# Altium schematic sheet System Control - SDRAM.SchDoc
size C
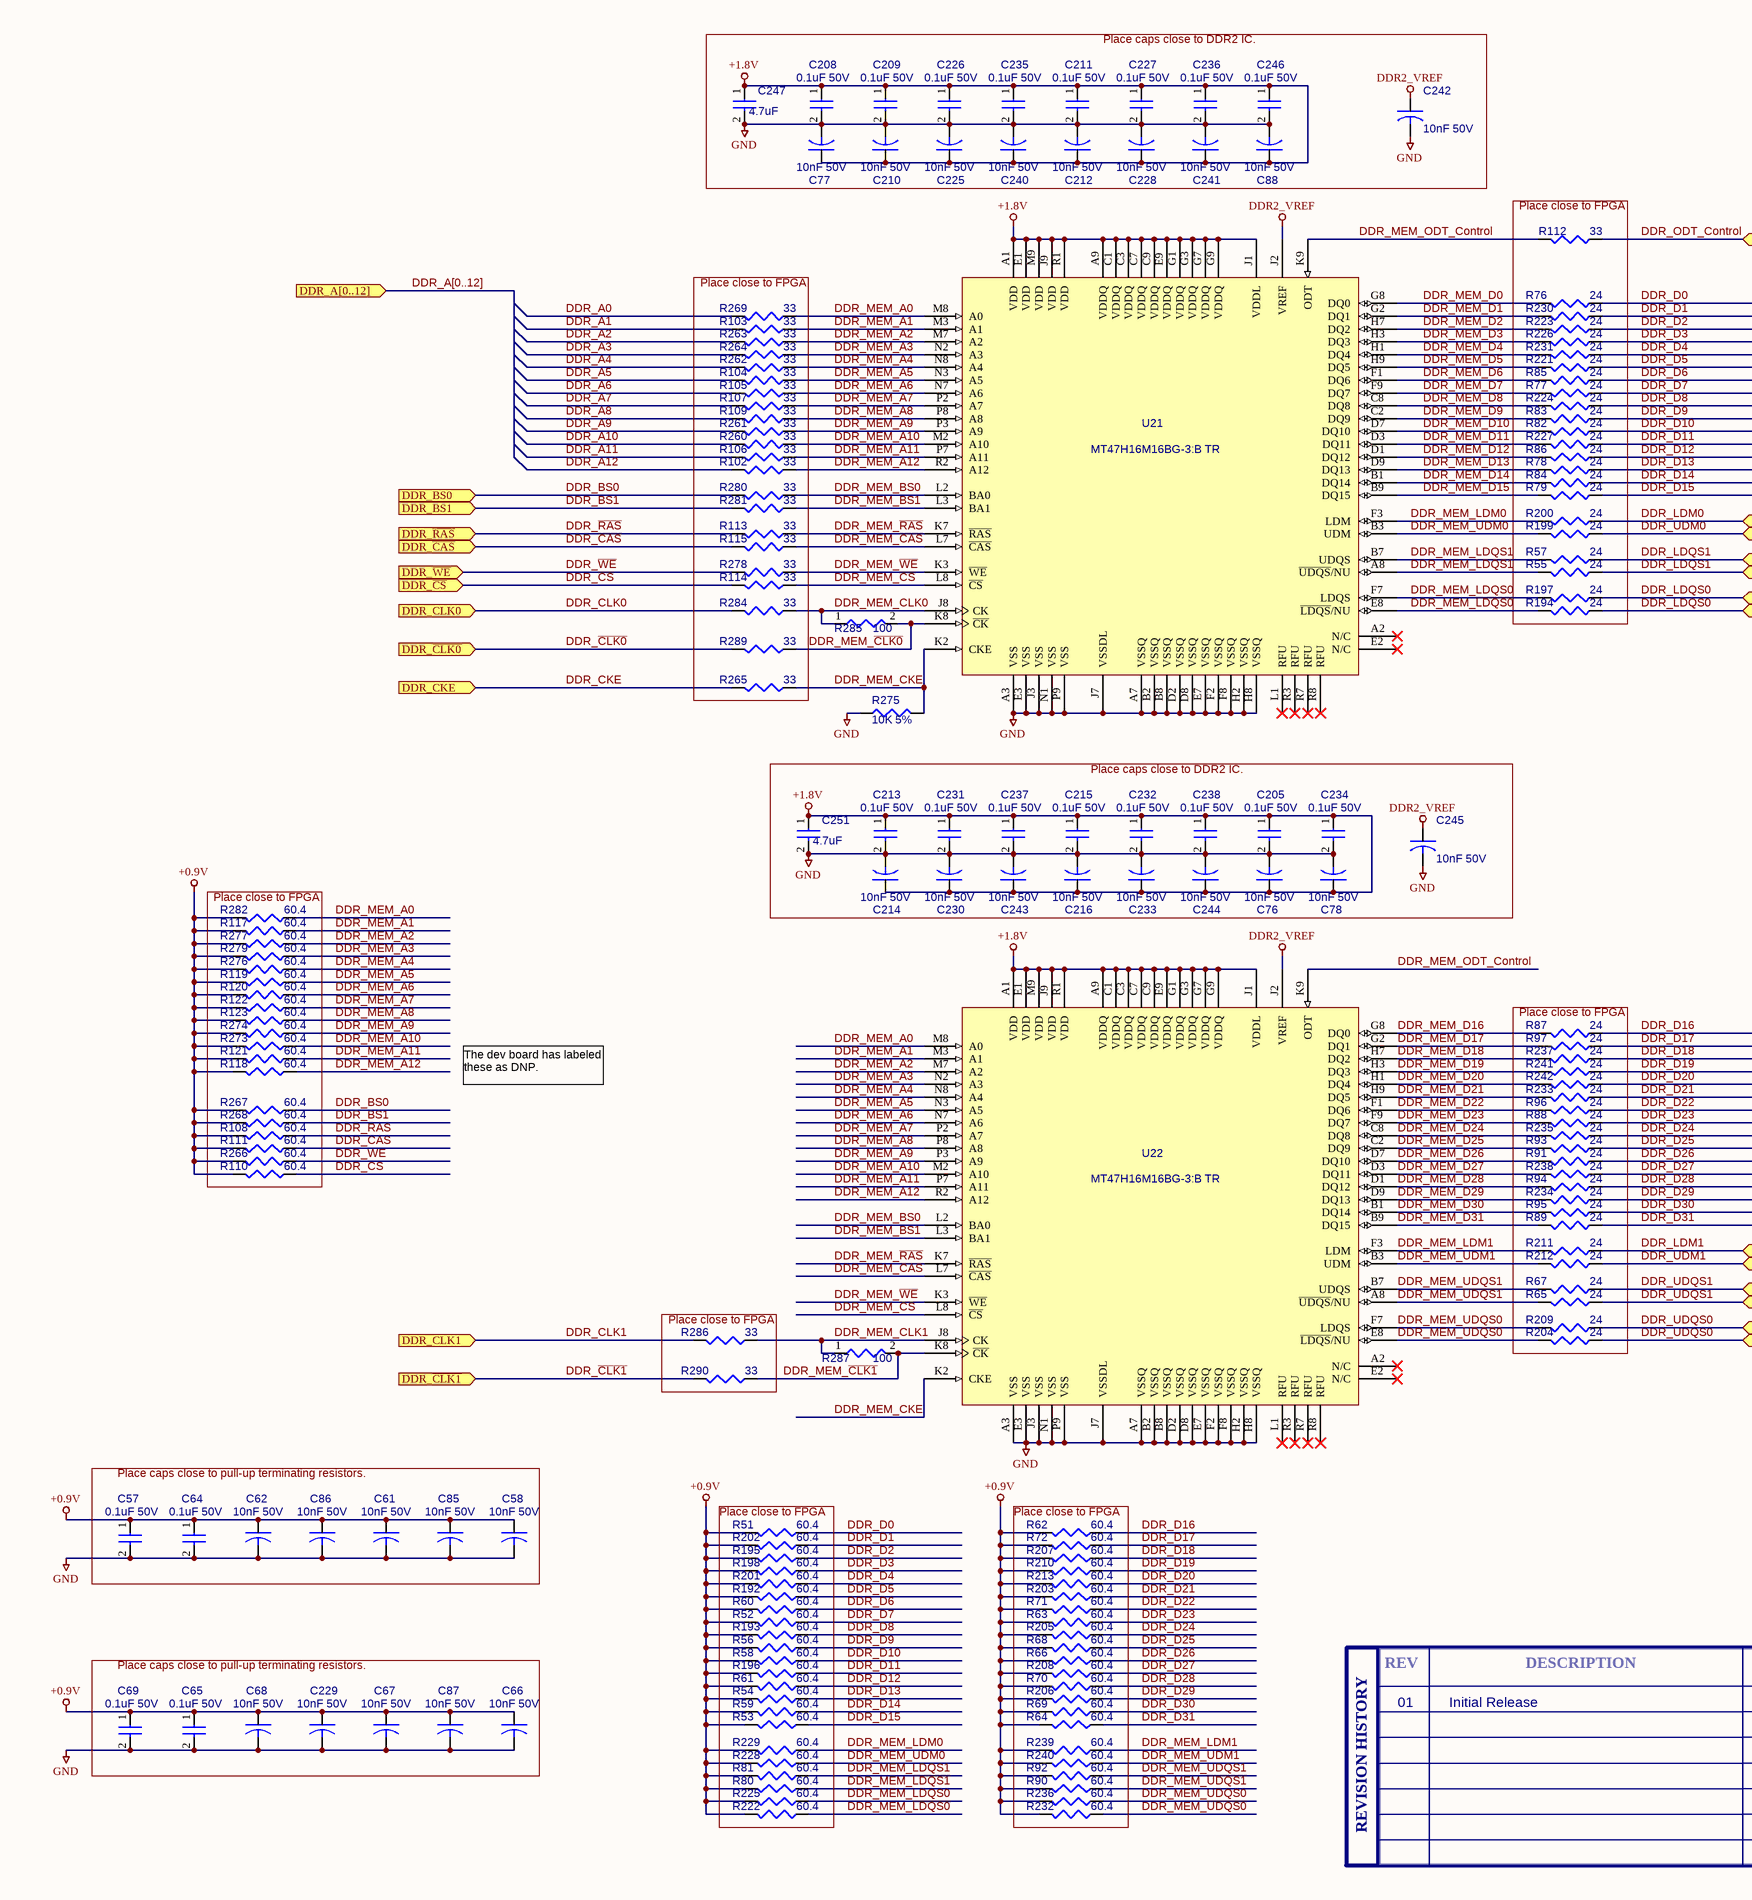
[diagram p0: System Control - SDRAM.SchDoc, left]
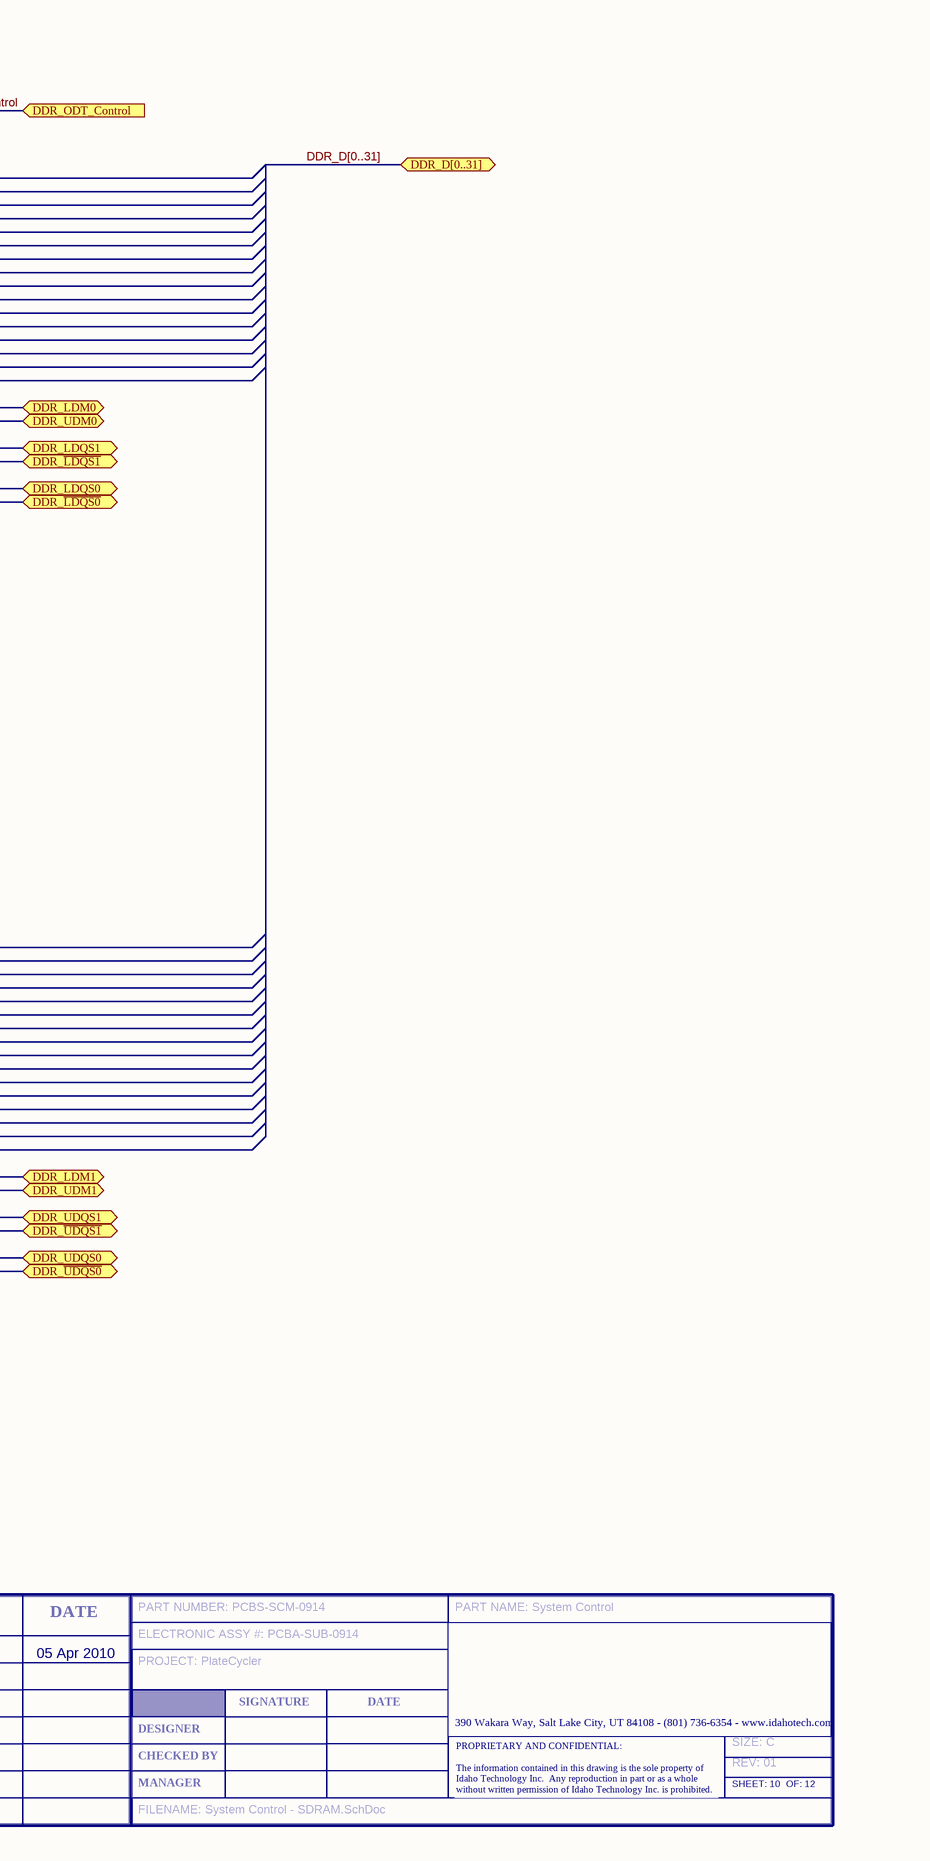
[diagram p1: System Control - SDRAM.SchDoc, right]

## Parts
C57  0.1uF 50V  [SM/C_0603]
C58  10nF 50V  [SM/C_0603]
C61  10nF 50V  [SM/C_0603]
C62  10nF 50V  [SM/C_0603]
C64  0.1uF 50V  [SM/C_0603]
C65  0.1uF 50V  [SM/C_0603]
C66  10nF 50V  [SM/C_0603]
C67  10nF 50V  [SM/C_0603]
C68  10nF 50V  [SM/C_0603]
C69  0.1uF 50V  [SM/C_0603]
C76  10nF 50V  [SM/C_0603]
C77  10nF 50V  [SM/C_0603]
C78  10nF 50V  [SM/C_0603]
C85  10nF 50V  [SM/C_0603]
C86  10nF 50V  [SM/C_0603]
C87  10nF 50V  [SM/C_0603]
C88  10nF 50V  [SM/C_0603]
C205  0.1uF 50V  [SM/C_0603]
C208  0.1uF 50V  [SM/C_0603]
C209  0.1uF 50V  [SM/C_0603]
C210  10nF 50V  [SM/C_0603]
C211  0.1uF 50V  [SM/C_0603]
C212  10nF 50V  [SM/C_0603]
C213  0.1uF 50V  [SM/C_0603]
C214  10nF 50V  [SM/C_0603]
C215  0.1uF 50V  [SM/C_0603]
C216  10nF 50V  [SM/C_0603]
C225  10nF 50V  [SM/C_0603]
C226  0.1uF 50V  [SM/C_0603]
C227  0.1uF 50V  [SM/C_0603]
C228  10nF 50V  [SM/C_0603]
C229  10nF 50V  [SM/C_0603]
C230  10nF 50V  [SM/C_0603]
C231  0.1uF 50V  [SM/C_0603]
C232  0.1uF 50V  [SM/C_0603]
C233  10nF 50V  [SM/C_0603]
C234  0.1uF 50V  [SM/C_0603]
C235  0.1uF 50V  [SM/C_0603]
C236  0.1uF 50V  [SM/C_0603]
C237  0.1uF 50V  [SM/C_0603]
C238  0.1uF 50V  [SM/C_0603]
C240  10nF 50V  [SM/C_0603]
C241  10nF 50V  [SM/C_0603]
C242  10nF 50V  [SM/C_0603]
C243  10nF 50V  [SM/C_0603]
C244  10nF 50V  [SM/C_0603]
C245  10nF 50V  [SM/C_0603]
C246  0.1uF 50V  [SM/C_0603]
C247  4.7uF  [SM/C_0603]
C251  4.7uF  [SM/C_0603]
R51  60.4  [SM/R_0402]
R52  60.4  [SM/R_0402]
R53  60.4  [SM/R_0402]
R54  60.4  [SM/R_0402]
R55  24  [SM/R_0402]
R56  60.4  [SM/R_0402]
R57  24  [SM/R_0402]
R58  60.4  [SM/R_0402]
R59  60.4  [SM/R_0402]
R60  60.4  [SM/R_0402]
R61  60.4  [SM/R_0402]
R62  60.4  [SM/R_0402]
R63  60.4  [SM/R_0402]
R64  60.4  [SM/R_0402]
R65  24  [SM/R_0402]
R66  60.4  [SM/R_0402]
R67  24  [SM/R_0402]
R68  60.4  [SM/R_0402]
R69  60.4  [SM/R_0402]
R70  60.4  [SM/R_0402]
R71  60.4  [SM/R_0402]
R72  60.4  [SM/R_0402]
R76  24  [SM/R_0402]
R77  24  [SM/R_0402]
R78  24  [SM/R_0402]
R79  24  [SM/R_0402]
R80  60.4  [SM/R_0402]
R81  60.4  [SM/R_0402]
R82  24  [SM/R_0402]
R83  24  [SM/R_0402]
R84  24  [SM/R_0402]
R85  24  [SM/R_0402]
R86  24  [SM/R_0402]
R87  24  [SM/R_0402]
R88  24  [SM/R_0402]
R89  24  [SM/R_0402]
R90  60.4  [SM/R_0402]
R91  24  [SM/R_0402]
R92  60.4  [SM/R_0402]
R93  24  [SM/R_0402]
R94  24  [SM/R_0402]
R95  24  [SM/R_0402]
R96  24  [SM/R_0402]
R97  24  [SM/R_0402]
R102  33  [SM/R_0402]
R103  33  [SM/R_0402]
R104  33  [SM/R_0402]
R105  33  [SM/R_0402]
R106  33  [SM/R_0402]
R107  33  [SM/R_0402]
R108  60.4  [SM/R_0402]
R109  33  [SM/R_0402]
R110  60.4  [SM/R_0402]
R111  60.4  [SM/R_0402]
R112  33  [SM/R_0402]
R113  33  [SM/R_0402]
R114  33  [SM/R_0402]
R115  33  [SM/R_0402]
R117  60.4  [SM/R_0402]
R118  60.4  [SM/R_0402]
R119  60.4  [SM/R_0402]
R120  60.4  [SM/R_0402]
R121  60.4  [SM/R_0402]
R122  60.4  [SM/R_0402]
R123  60.4  [SM/R_0402]
R192  60.4  [SM/R_0402]
R193  60.4  [SM/R_0402]
R194  24  [SM/R_0402]
R195  60.4  [SM/R_0402]
R196  60.4  [SM/R_0402]
R197  24  [SM/R_0402]
R198  60.4  [SM/R_0402]
R199  24  [SM/R_0402]
R200  24  [SM/R_0402]
R201  60.4  [SM/R_0402]
R202  60.4  [SM/R_0402]
R203  60.4  [SM/R_0402]
R204  24  [SM/R_0402]
R205  60.4  [SM/R_0402]
R206  60.4  [SM/R_0402]
R207  60.4  [SM/R_0402]
R208  60.4  [SM/R_0402]
R209  24  [SM/R_0402]
R210  60.4  [SM/R_0402]
R211  24  [SM/R_0402]
R212  24  [SM/R_0402]
R213  60.4  [SM/R_0402]
R221  24  [SM/R_0402]
R222  60.4  [SM/R_0402]
R223  24  [SM/R_0402]
R224  24  [SM/R_0402]
R225  60.4  [SM/R_0402]
R226  24  [SM/R_0402]
R227  24  [SM/R_0402]
R228  60.4  [SM/R_0402]
R229  60.4  [SM/R_0402]
R230  24  [SM/R_0402]
R231  24  [SM/R_0402]
R232  60.4  [SM/R_0402]
R233  24  [SM/R_0402]
R234  24  [SM/R_0402]
R235  24  [SM/R_0402]
R236  60.4  [SM/R_0402]
R237  24  [SM/R_0402]
R238  24  [SM/R_0402]
R239  60.4  [SM/R_0402]
R240  60.4  [SM/R_0402]
R241  24  [SM/R_0402]
R242  24  [SM/R_0402]
R260  33  [SM/R_0402]
R261  33  [SM/R_0402]
R262  33  [SM/R_0402]
R263  33  [SM/R_0402]
R264  33  [SM/R_0402]
R265  33  [SM/R_0402]
R266  60.4  [SM/R_0402]
R267  60.4  [SM/R_0402]
R268  60.4  [SM/R_0402]
R269  33  [SM/R_0402]
R273  60.4  [SM/R_0402]
R274  60.4  [SM/R_0402]
R275  10K 5%  [SM/R_0603]
R276  60.4  [SM/R_0402]
R277  60.4  [SM/R_0402]
R278  33  [SM/R_0402]
R279  60.4  [SM/R_0402]
R280  33  [SM/R_0402]
R281  33  [SM/R_0402]
R282  60.4  [SM/R_0402]
R284  33  [SM/R_0402]
R285  100  [SM/R_0603]
R286  33  [SM/R_0402]
R287  100  [SM/R_0603]
R289  33  [SM/R_0402]
R290  33  [SM/R_0402]
T?  SIZE: C  REV: 01  FILENAME: System Control - SDRAM.SchDoc  PART NUMBER: PCBS-SCM-0914  PART NAME: System Control  ELECTRONIC ASSY #: PCBA-SUB-0914  PROJECT: PlateCycler  SHEET: 10  OF: 12  (hidden comment: ITI Title Block, A Size)  (graphical)
U21  MT47H16M16BG-3:B TR  [84FBGA]
U22  MT47H16M16BG-3:B TR  [84FBGA]

## Blocks framed on the sheet
Place caps close to DDR2 IC.: C77 C88 C208-C212 C225-C228 C235 C236 C240-C242 C246 C247
Place close to FPGA: R55 R57 R76-R79 R82-R86 R112 R194 R197 R199 R200 R221 R223 R224 R226 R227 R230 R231
Place close to FPGA: R102-R107 R109 R113-R115 R260-R265 R269 R278 R280 R281 R284 R289
Place caps close to DDR2 IC.: C76 C78 C205 C213-C216 C230-C234 C237 C238 C243-C245 C251
Place close to FPGA: R108 R110 R111 R117-R123 R266-R268 R273 R274 R276 R277 R279 R282
Place close to FPGA: R65 R67 R87-R89 R91 R93-R97 R204 R209 R211 R212 R233-R235 R237 R238 R241 R242
Place close to FPGA: R286 R290
Place caps close to pull-up terminating resistors.: C57 C58 C61 C62 C64 C85 C86
Place close to FPGA: R51-R54 R56 R58-R61 R80 R81 R192 R193 R195 R196 R198 R201 R202 R222 R225 R228 R229
Place close to FPGA: R62-R64 R66 R68-R72 R90 R92 R203 R205-R208 R210 R213 R232 R236 R239 R240
Place caps close to pull-up terminating resistors.: C65-C69 C87 C229

## Ports
DDR_A[0..12] (in), DDR_BS0 (in), DDR_BS1 (in), DDR_CKE (in), DDR_CLK0 (in), DDR_CLK1 (in), DDR_D[0..31] (bidir), DDR_LDM0 (bidir), DDR_LDM1 (bidir), DDR_LDQS0 (bidir), DDR_LDQS1 (bidir), DDR_ODT_Control (in), DDR_UDM0 (bidir), DDR_UDM1 (bidir), DDR_UDQS0 (bidir), DDR_UDQS1 (bidir), DDR_~{CAS} (in), DDR_~{CLK0} (in), DDR_~{CLK1} (in), DDR_~{CS} (in), DDR_~{LDQS0} (bidir), DDR_~{LDQS1} (bidir), DDR_~{RAS} (in), DDR_~{UDQS0} (bidir), DDR_~{UDQS1} (bidir), DDR_~{WE} (in)

## Nets
+0.9V: C57.1 C58.1 C61.1 C62.1 C64.1 C65.1 C66.1 C67.1 C68.1 C69.1 C85.1 C86.1 C87.1 C229.1 R51.2 R52.2 R53.2 R54.2 R56.2 R58.2 R59.2 R60.2 R61.2 R62.2 R63.2 R64.2 R66.2 R68.2 R69.2 R70.2 R71.2 R72.2 R80.2 R81.2 R90.2 R92.2 R108.2 R110.2 R111.2 R117.2 R118.2 R119.2 R120.2 R121.2 R122.2 R123.2 R192.2 R193.2 R195.2 R196.2 R198.2 R201.2 R202.2 R203.2 R205.2 R206.2 R207.2 R208.2 R210.2 R213.2 R222.2 R225.2 R228.2 R229.2 R232.2 R236.2 R239.2 R240.2 R266.2 R267.2 R268.2 R273.2 R274.2 R276.2 R277.2 R279.2 R282.2
+1.8V: C76.1 C77.1 C78.1 C88.1 C205.1 C208.1 C209.1 C210.1 C211.1 C212.1 C213.1 C214.1 C215.1 C216.1 C225.1 C226.1 C227.1 C228.1 C230.1 C231.1 C232.1 C233.1 C234.1 C235.1 C236.1 C237.1 C238.1 C240.1 C241.1 C243.1 C244.1 C246.1 C247.1 C251.1 U21.A1(VDD) U21.A9(VDDQ) U21.C1(VDDQ) U21.C3(VDDQ) U21.C7(VDDQ) U21.C9(VDDQ) U21.E1(VDD) U21.E9(VDDQ) U21.G1(VDDQ) U21.G3(VDDQ) U21.G7(VDDQ) U21.G9(VDDQ) U21.J1(VDDL) U21.J9(VDD) U21.M9(VDD) U21.R1(VDD) U22.A1(VDD) U22.A9(VDDQ) U22.C1(VDDQ) U22.C3(VDDQ) U22.C7(VDDQ) U22.C9(VDDQ) U22.E1(VDD) U22.E9(VDDQ) U22.G1(VDDQ) U22.G3(VDDQ) U22.G7(VDDQ) U22.G9(VDDQ) U22.J1(VDDL) U22.J9(VDD) U22.M9(VDD) U22.R1(VDD)
DDR2_VREF: C242.1 C245.1 U21.J2(VREF) U22.J2(VREF)
GND: C57.2 C58.2 C61.2 C62.2 C64.2 C65.2 C66.2 C67.2 C68.2 C69.2 C76.2 C77.2 C78.2 C85.2 C86.2 C87.2 C88.2 C205.2 C208.2 C209.2 C210.2 C211.2 C212.2 C213.2 C214.2 C215.2 C216.2 C225.2 C226.2 C227.2 C228.2 C229.2 C230.2 C231.2 C232.2 C233.2 C234.2 C235.2 C236.2 C237.2 C238.2 C240.2 C241.2 C242.2 C243.2 C244.2 C245.2 C246.2 C247.2 C251.2 R275.1 U21.A3(VSS) U21.A7(VSSQ) U21.B2(VSSQ) U21.B8(VSSQ) U21.D2(VSSQ) U21.D8(VSSQ) U21.E3(VSS) U21.E7(VSSQ) U21.F2(VSSQ) U21.F8(VSSQ) U21.H2(VSSQ) U21.H8(VSSQ) U21.J3(VSS) U21.J7(VSSDL) U21.N1(VSS) U21.P9(VSS) U22.A3(VSS) U22.A7(VSSQ) U22.B2(VSSQ) U22.B8(VSSQ) U22.D2(VSSQ) U22.D8(VSSQ) U22.E3(VSS) U22.E7(VSSQ) U22.F2(VSSQ) U22.F8(VSSQ) U22.H2(VSSQ) U22.H8(VSSQ) U22.J3(VSS) U22.J7(VSSDL) U22.N1(VSS) U22.P9(VSS)
DDR_A0: R269.2
DDR_A1: R103.2
DDR_A2: R263.2
DDR_A3: R264.2
DDR_A4: R262.2
DDR_A5: R104.2
DDR_A6: R105.2
DDR_A7: R107.2
DDR_A8: R109.2
DDR_A9: R261.2
DDR_A10: R260.2
DDR_A11: R106.2
DDR_A12: R102.2
DDR_BS0: R267.1 R280.2 ; port DDR_BS0
DDR_BS1: R268.1 R281.2 ; port DDR_BS1
DDR_~{CAS}: R111.1 R115.2 ; port DDR_~{CAS}
DDR_~{CLK0}: R289.2 ; port DDR_~{CLK0}
DDR_~{CLK1}: R290.2 ; port DDR_~{CLK1}
DDR_~{CS}: R110.1 R114.2 ; port DDR_~{CS}
DDR_CKE: R265.2 ; port DDR_CKE
DDR_CLK0: R284.2 ; port DDR_CLK0
DDR_CLK1: R286.2 ; port DDR_CLK1
DDR_D0: R51.1 R76.1
DDR_D1: R202.1 R230.1
DDR_D2: R195.1 R223.1
DDR_D3: R198.1 R226.1
DDR_D4: R201.1 R231.1
DDR_D5: R192.1 R221.1
DDR_D6: R60.1 R85.1
DDR_D7: R52.1 R77.1
DDR_D8: R193.1 R224.1
DDR_D9: R56.1 R83.1
DDR_D10: R58.1 R82.1
DDR_D11: R196.1 R227.1
DDR_D12: R61.1 R86.1
DDR_D13: R54.1 R78.1
DDR_D14: R59.1 R84.1
DDR_D15: R53.1 R79.1
DDR_D16: R62.1 R87.1
DDR_D17: R72.1 R97.1
DDR_D18: R207.1 R237.1
DDR_D19: R210.1 R241.1
DDR_D20: R213.1 R242.1
DDR_D21: R203.1 R233.1
DDR_D22: R71.1 R96.1
DDR_D23: R63.1 R88.1
DDR_D24: R205.1 R235.1
DDR_D25: R68.1 R93.1
DDR_D26: R66.1 R91.1
DDR_D27: R208.1 R238.1
DDR_D28: R70.1 R94.1
DDR_D29: R206.1 R234.1
DDR_D30: R69.1 R95.1
DDR_D31: R64.1 R89.1
DDR_~{LDQS0}: R194.1 ; port DDR_~{LDQS0}
DDR_~{LDQS1}: R55.1 ; port DDR_~{LDQS1}
DDR_LDM0: R200.1 ; port DDR_LDM0
DDR_LDM1: R211.1 ; port DDR_LDM1
DDR_LDQS0: R197.1 ; port DDR_LDQS0
DDR_LDQS1: R57.1 ; port DDR_LDQS1
DDR_MEM_A0: R269.1 R282.1 U21.M8(A0) U22.M8(A0)
DDR_MEM_A1: R103.1 R117.1 U21.M3(A1) U22.M3(A1)
DDR_MEM_A2: R263.1 R277.1 U21.M7(A2) U22.M7(A2)
DDR_MEM_A3: R264.1 R279.1 U21.N2(A3) U22.N2(A3)
DDR_MEM_A4: R262.1 R276.1 U21.N8(A4) U22.N8(A4)
DDR_MEM_A5: R104.1 R119.1 U21.N3(A5) U22.N3(A5)
DDR_MEM_A6: R105.1 R120.1 U21.N7(A6) U22.N7(A6)
DDR_MEM_A7: R107.1 R122.1 U21.P2(A7) U22.P2(A7)
DDR_MEM_A8: R109.1 R123.1 U21.P8(A8) U22.P8(A8)
DDR_MEM_A9: R261.1 R274.1 U21.P3(A9) U22.P3(A9)
DDR_MEM_A10: R260.1 R273.1 U21.M2(A10) U22.M2(A10)
DDR_MEM_A11: R106.1 R121.1 U21.P7(A11) U22.P7(A11)
DDR_MEM_A12: R102.1 R118.1 U21.R2(A12) U22.R2(A12)
DDR_MEM_BS0: R280.1 U21.L2(BA0) U22.L2(BA0)
DDR_MEM_BS1: R281.1 U21.L3(BA1) U22.L3(BA1)
DDR_MEM_~{CAS}: R115.1 U21.L7(~{CAS}) U22.L7(~{CAS})
DDR_MEM_~{CLK0}: R285.2 R289.1 U21.K8(~{CK})
DDR_MEM_~{CLK1}: R287.2 R290.1 U22.K8(~{CK})
DDR_MEM_~{CS}: R114.1 U21.L8(~{CS}) U22.L8(~{CS})
DDR_MEM_CKE: R265.1 R275.2 U21.K2(CKE) U22.K2(CKE)
DDR_MEM_CLK0: R284.1 R285.1 U21.J8(CK)
DDR_MEM_CLK1: R286.1 R287.1 U22.J8(CK)
DDR_MEM_D0: R76.2 U21.G8(DQ0)
DDR_MEM_D1: R230.2 U21.G2(DQ1)
DDR_MEM_D2: R223.2 U21.H7(DQ2)
DDR_MEM_D3: R226.2 U21.H3(DQ3)
DDR_MEM_D4: R231.2 U21.H1(DQ4)
DDR_MEM_D5: R221.2 U21.H9(DQ5)
DDR_MEM_D6: R85.2 U21.F1(DQ6)
DDR_MEM_D7: R77.2 U21.F9(DQ7)
DDR_MEM_D8: R224.2 U21.C8(DQ8)
DDR_MEM_D9: R83.2 U21.C2(DQ9)
DDR_MEM_D10: R82.2 U21.D7(DQ10)
DDR_MEM_D11: R227.2 U21.D3(DQ11)
DDR_MEM_D12: R86.2 U21.D1(DQ12)
DDR_MEM_D13: R78.2 U21.D9(DQ13)
DDR_MEM_D14: R84.2 U21.B1(DQ14)
DDR_MEM_D15: R79.2 U21.B9(DQ15)
DDR_MEM_D16: R87.2 U22.G8(DQ0)
DDR_MEM_D17: R97.2 U22.G2(DQ1)
DDR_MEM_D18: R237.2 U22.H7(DQ2)
DDR_MEM_D19: R241.2 U22.H3(DQ3)
DDR_MEM_D20: R242.2 U22.H1(DQ4)
DDR_MEM_D21: R233.2 U22.H9(DQ5)
DDR_MEM_D22: R96.2 U22.F1(DQ6)
DDR_MEM_D23: R88.2 U22.F9(DQ7)
DDR_MEM_D24: R235.2 U22.C8(DQ8)
DDR_MEM_D25: R93.2 U22.C2(DQ9)
DDR_MEM_D26: R91.2 U22.D7(DQ10)
DDR_MEM_D27: R238.2 U22.D3(DQ11)
DDR_MEM_D28: R94.2 U22.D1(DQ12)
DDR_MEM_D29: R234.2 U22.D9(DQ13)
DDR_MEM_D30: R95.2 U22.B1(DQ14)
DDR_MEM_D31: R89.2 U22.B9(DQ15)
DDR_MEM_~{LDQS0}: R194.2 R222.1 U21.E8(~{LDQS}/NU)
DDR_MEM_~{LDQS1}: R55.2 R80.1 U21.A8(~{UDQS}/NU)
DDR_MEM_LDM0: R200.2 R229.1 U21.F3(LDM)
DDR_MEM_LDM1: R211.2 R239.1 U22.F3(LDM)
DDR_MEM_LDQS0: R197.2 R225.1 U21.F7(LDQS)
DDR_MEM_LDQS1: R57.2 R81.1 U21.B7(UDQS)
DDR_MEM_ODT_Control: R112.2 U21.K9(ODT) U22.K9(ODT)
DDR_MEM_~{RAS}: R113.1 U21.K7(~{RAS}) U22.K7(~{RAS})
DDR_MEM_~{UDQS0}: R204.2 R232.1 U22.E8(~{LDQS}/NU)
DDR_MEM_~{UDQS1}: R65.2 R90.1 U22.A8(~{UDQS}/NU)
DDR_MEM_UDM0: R199.2 R228.1 U21.B3(UDM)
DDR_MEM_UDM1: R212.2 R240.1 U22.B3(UDM)
DDR_MEM_UDQS0: R209.2 R236.1 U22.F7(LDQS)
DDR_MEM_UDQS1: R67.2 R92.1 U22.B7(UDQS)
DDR_MEM_~{WE}: R278.1 U21.K3(~{WE}) U22.K3(~{WE})
DDR_ODT_Control: R112.1 ; port DDR_ODT_Control
DDR_~{RAS}: R108.1 R113.2 ; port DDR_~{RAS}
DDR_~{UDQS0}: R204.1 ; port DDR_~{UDQS0}
DDR_~{UDQS1}: R65.1 ; port DDR_~{UDQS1}
DDR_UDM0: R199.1 ; port DDR_UDM0
DDR_UDM1: R212.1 ; port DDR_UDM1
DDR_UDQS0: R209.1 ; port DDR_UDQS0
DDR_UDQS1: R67.1 ; port DDR_UDQS1
DDR_~{WE}: R266.1 R278.2 ; port DDR_~{WE}

Not connected (* = marked no-connect by the designer): U21 A2(N/C)* E2(N/C)* L1(RFU)* R3(RFU)* R7(RFU)* R8(RFU)*; U22 A2(N/C)* E2(N/C)* L1(RFU)* R3(RFU)* R7(RFU)* R8(RFU)*

## Buses and harness runs
bus DDR_A[0..12] = port DDR_A[0..12]
bus DDR_D[0..31] = port DDR_D[0..31]

## Notes on the sheet
- The dev board has labeled
  these as DNP.
- 01
- Initial Release
- 05 Apr 2010
- (in symbol ITI A-size Title Block and Rev Table) REV; DESCRIPTION; DATE; SIGNATURE; 390 Wakara Way, Salt Lake City, UT 84108 - (801) 736-6354 - www.idahotech.com; DESIGNER; CHECKED BY; REVISION HISTORY; MANAGER; PROPRIETARY AND CONFIDENTIAL: / The information contained in this drawing is the sole property of / Idaho Technology Inc.  Any reproduction in part or as a whole / without written permission of Idaho Technology Inc. is prohibited.

## Library data of the parts
C57 C64 C65 C69 C205 C208 C209 C211 C213 C215 C226 C227 C231 C232 C234-C238 C246 = CAP NP_1: CAP CER .10UF 50V X7R 0603; Manufacturer P/N: UMK107B7104KA-T; Manufacturer: Taiyo Yuden; Vendor P/N: 587-1243-1-ND; Vendor: Digikey
C58 C61 C62 C66-C68 C76-C78 C85-C88 C210 C212 C214 C216 C225 C228-C230 C233 C240-C245 = C10nF 50V X7R 0603: CAP 10000PF 50V CERM X7R 0603; Manufacturer: Panasonic; Manufacturer P/N: ECJ-1VB1H103K; Vendor P/N: PCC1784CT-ND; Vendor: Digikey
C247 C251 = CAP NP_1: CAP CER 4.7UF 10V Y5V 0603; Manufacturer P/N: GRM188F51A475ZE20D; Manufacturer: Murata; Vendor P/N: 490-3302-1-ND; Vendor: Digikey
R51-R54 R56 R58-R64 R66 R68-R72 R80 R81 R90 R92 R108 R110 R111 R117-R123 R192 R193 R195 R196 R198 R201-R203 R205-R208 R210 R213 R222 R225 R228 R229 R232 R236 R239 R240 R266-R268 R273 R274 R276 R277 R279 R282 = R1K 5% 0603: RES 60.4 OHM 1/16W 1% 0402 SMD; Manufacturer: Panasonic; Manufacturer P/N: ERJ-2RKF60R4X; Vendor: Digikey; Vendor P/N: P60.4LCT-ND
R55 R57 R65 R67 R76-R79 R82-R89 R91 R93-R97 R194 R197 R199 R200 R204 R209 R211 R212 R221 R223 R224 R226 R227 R230 R231 R233-R235 R237 R238 R241 R242 = R1K 5% 0603: RES 24.0 OHM 1/16W 1% 0402 SMD; Manufacturer: Panasonic; Manufacturer P/N: ERJ-2RKF24R0X; Vendor: Digikey; Vendor P/N: P24.0LCT-ND
R102-R107 R109 R112-R115 R260-R265 R269 R278 R280 R281 R284 R286 R289 R290 = R1K 5% 0603: RES 33.0 OHM 1/16W 1% 0402 SMD; Manufacturer: Panasonic; Manufacturer P/N: ERJ-2RKF33R0X; Vendor: Digikey; Vendor P/N: P33.0LCT-ND
R275 = R10K 5% 0603: RES 10K OHM 1/10W 5% 0603 SMD; Manufacturer: Panasonic; Manufacturer P/N: ERJ-3GEYJ103V; Vendor: Digikey; Vendor P/N: P10KGCT-ND
R285 R287 = RESISTOR_0: RES 100 OHM 1/16W .5% 0603 SMD; Manufacturer: Susumu; Manufacturer P/N: RR0816P-101-D; Vendor: Digikey; Vendor P/N: RR08P100DCT-ND
T? = ITI A-size Title Block and Rev Table: ITI Title Block and Rev Table, A Size
U21 U22 = MT47H32M16BN-3:D TR: IC DDR2 SDRAM 256MB 84-FBGA; Manufacturer: Micron Technology Inc; Vendor: Digikey; Vendor P/N: 557-1046-1-ND; Manufacturer P/N: MT47H16M16BG-3:B TR